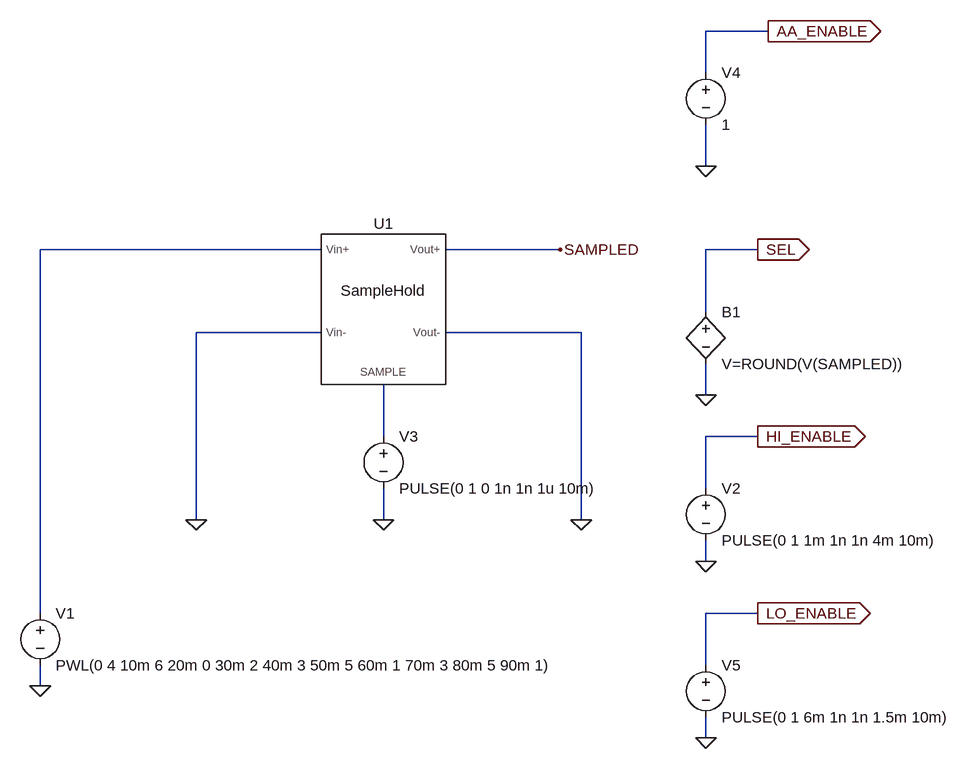
[diagram p0: schematic Scheduler.asc]
Scheduler.asc, the LTspice schematic file:
Version 4
SHEET 1 2056 680
WIRE 1488 -480 1392 -480
WIRE 1392 -416 1392 -480
WIRE 1392 -272 1392 -336
WIRE 800 -144 368 -144
WIRE 1168 -144 992 -144
WIRE 1472 -144 1392 -144
WIRE 1392 -48 1392 -144
WIRE 800 -16 608 -16
WIRE 1200 -16 992 -16
WIRE 1392 80 1392 32
WIRE 896 144 896 64
WIRE 1472 144 1392 144
WIRE 1392 224 1392 144
WIRE 608 272 608 -16
WIRE 896 272 896 224
WIRE 1200 272 1200 -16
WIRE 1392 336 1392 304
WIRE 368 416 368 -144
WIRE 1472 416 1392 416
WIRE 1392 496 1392 416
WIRE 368 528 368 496
WIRE 1392 608 1392 576
FLAG 368 528 0
FLAG 1392 336 0
FLAG 896 272 0
FLAG 1200 272 0
FLAG 608 272 0
FLAG 1472 -144 SEL
IOPIN 1472 -144 Out
FLAG 1472 144 HI_ENABLE
IOPIN 1472 144 Out
FLAG 1392 -272 0
FLAG 1488 -480 AA_ENABLE
IOPIN 1488 -480 Out
FLAG 1392 80 0
FLAG 1168 -144 SAMPLED
FLAG 1392 608 0
FLAG 1472 416 LO_ENABLE
IOPIN 1472 416 Out
SYMBOL voltage 368 400 R0
WINDOW 123 0 0 Left 0
WINDOW 39 0 0 Left 0
SYMATTR InstName V1
SYMATTR Value PWL(0 4 10m 6 20m 0 30m 2 40m 3 50m 5 60m 1 70m 3 80m 5 90m 1)
SYMBOL voltage 1392 208 R0
WINDOW 123 0 0 Left 0
WINDOW 39 0 0 Left 0
SYMATTR InstName V2
SYMATTR Value PULSE(0 1 1m 1n 1n 4m 10m)
SYMBOL sample-hold 896 -64 R0
SYMATTR InstName U1
SYMBOL voltage 896 128 R0
WINDOW 123 0 0 Left 0
WINDOW 39 0 0 Left 0
SYMATTR InstName V3
SYMATTR Value PULSE(0 1 0 1n 1n 1u 10m)
SYMBOL voltage 1392 -432 R0
WINDOW 123 0 0 Left 0
WINDOW 39 0 0 Left 0
SYMATTR InstName V4
SYMATTR Value 1
SYMBOL bv 1392 -64 R0
SYMATTR InstName B1
SYMATTR Value V=ROUND(V(SAMPLED))
SYMBOL voltage 1392 480 R0
WINDOW 123 0 0 Left 0
WINDOW 39 0 0 Left 0
SYMATTR InstName V5
SYMATTR Value PULSE(0 1 6m 1n 1n 1.5m 10m)

The netlist it stands for:
* Scheduler.asc
V1 N001 0 PWL(0 4 10m 6 20m 0 30m 2 40m 3 50m 5 60m 1 70m 3 80m 5 90m 1)
V2 HI_ENABLE 0 PULSE(0 1 1m 1n 1n 4m 10m)
XU1 N002 N001 0 SAMPLED 0 SampleHold  ; pins SAMPLE Vin+ Vin- Vout+ Vout-
V3 N002 0 PULSE(0 1 0 1n 1n 1u 10m)
V4 AA_ENABLE 0 1
B1 SEL 0 V=ROUND(V(SAMPLED))
V5 LO_ENABLE 0 PULSE(0 1 6m 1n 1n 1.5m 10m)
.lib sample-hold.sub
.backanno
.end